# EAGLE design sub_sys_pdu (EAGLE 9.6.0)
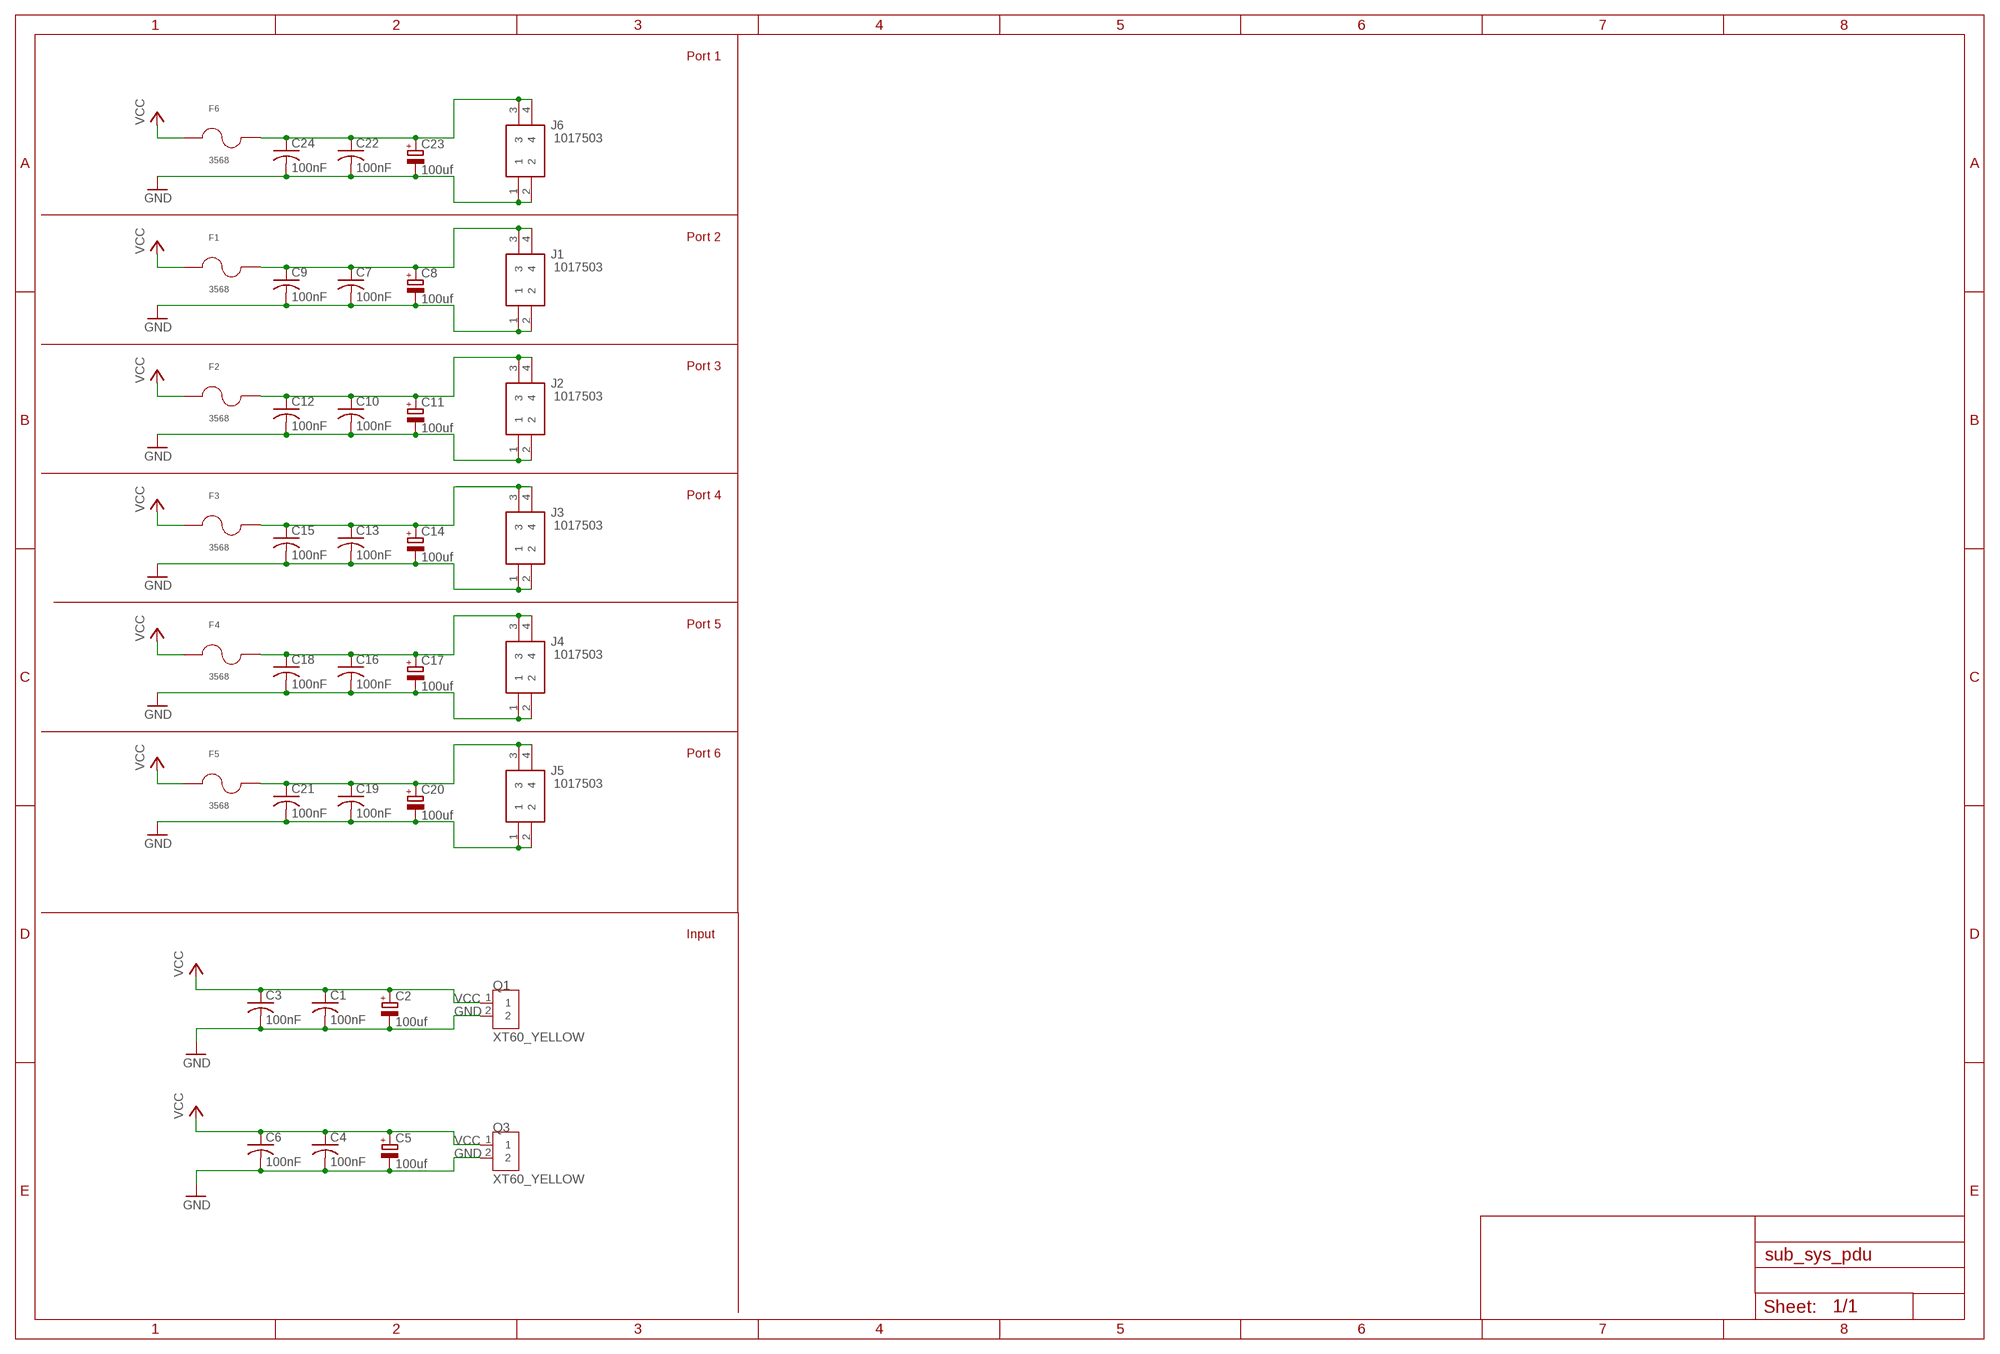
[diagram p0: schematic, sheet 1]

## Parts
C1  100nF  C-USC0805  [C0805]
C2  100uf  CPOL-EUE5-10.5  [E5-10,5]
C3  100nF  C-USC0805  [C0805]
C4  100nF  C-USC0805  [C0805]
C5  100uf  CPOL-EUE5-10.5  [E5-10,5]
C6  100nF  C-USC0805  [C0805]
C7  100nF  C-USC0805  [C0805]
C8  100uf  CPOL-EUE5-10.5  [E5-10,5]
C9  100nF  C-USC0805  [C0805]
C10  100nF  C-USC0805  [C0805]
C11  100uf  CPOL-EUE5-10.5  [E5-10,5]
C12  100nF  C-USC0805  [C0805]
C13  100nF  C-USC0805  [C0805]
C14  100uf  CPOL-EUE5-10.5  [E5-10,5]
C15  100nF  C-USC0805  [C0805]
C16  100nF  C-USC0805  [C0805]
C17  100uf  CPOL-EUE5-10.5  [E5-10,5]
C18  100nF  C-USC0805  [C0805]
C19  100nF  C-USC0805  [C0805]
C20  100uf  CPOL-EUE5-10.5  [E5-10,5]
C21  100nF  C-USC0805  [C0805]
C22  100nF  C-USC0805  [C0805]
C23  100uf  CPOL-EUE5-10.5  [E5-10,5]
C24  100nF  C-USC0805  [C0805]
F1  3568  [FUSE_3568]
F2  3568  [FUSE_3568]
F3  3568  [FUSE_3568]
F4  3568  [FUSE_3568]
F5  3568  [FUSE_3568]
F6  3568  [FUSE_3568]
J1  1017503  [1017503]
J2  1017503  [1017503]
J3  1017503  [1017503]
J4  1017503  [1017503]
J5  1017503  [1017503]
J6  1017503  [1017503]
Q1  XT60_YELLOW  [AMASS_XT60PB-M]
Q3  XT60_YELLOW  [AMASS_XT60PB-M]

## Nets
GND: C1.2 C2.- C3.2 C4.2 C5.- C6.2 C7.2 C8.- C9.2 C10.2 C11.- C12.2 C13.2 C14.- C15.2 C16.2 C17.- C18.2 C19.2 C20.- C21.2 C22.2 C23.- C24.2 J1.1 J1.2 J2.1 J2.2 J3.1 J3.2 J4.1 J4.2 J5.1 J5.2 J6.1 J6.2 Q1.2 Q3.2
N$1: C7.1 C8.+ C9.1 F1.2 F1.4 J1.3 J1.4
N$2: C10.1 C11.+ C12.1 F2.2 F2.4 J2.3 J2.4
N$3: C13.1 C14.+ C15.1 F3.2 F3.4 J3.3 J3.4
N$4: C16.1 C17.+ C18.1 F4.2 F4.4 J4.3 J4.4
N$5: C19.1 C20.+ C21.1 F5.2 F5.4 J5.3 J5.4
N$6: C22.1 C23.+ C24.1 F6.2 F6.4 J6.3 J6.4
VCC: C1.1 C2.+ C3.1 C4.1 C5.+ C6.1 F1.1 F1.3 F2.1 F2.3 F3.1 F3.3 F4.1 F4.3 F5.1 F5.3 F6.1 F6.3 Q1.1 Q3.1

## Notes on the sheet
- Port 1
- Port 2
- Port 3
- Port 4
- Port 5
- Port 6
- Input

## Library data of the parts
C1 C3 C4 C6 C7 C9 C10 C12 C13 C15 C16 C18 C19 C21 C22 C24 = rcl:C-US: CAPACITOR, American symbol; SPICEPREFIX: C
C2 C5 C8 C11 C14 C17 C20 C23 = rcl:CPOL-EU: POLARIZED CAPACITOR, European symbol; SPICEPREFIX: C
F1-F6 = 3568:3568: Auto Fuse Holder; Mini; THM; 1 Fuse; 30Amp; Hi-Temp Nylon; UL94V-0; Brass/Tin; AVAILABILITY: Unavailable; DESCRIPTION: STEMMA CABLE - 150MM/6 LONG 4 PI; MF: Adafruit Industries; MP: 3568; PACKAGE: None; PRICE: None
J1-J6 = 1017503:1017503: Phoenix Contact TDPT Series 5.08mm Pitch, PCB Terminal Block, PCB Mount, 2 Way Source: Datasheet <https://www.phoenixcontact.com/online/portal/gb?uri=pxc-oc-itemdetail:pid=1017503&library=gben&tab=1>; DESCRIPTION: Phoenix Contact TDPT Series 5.08mm Pitch, PCB Terminal Block, PCB Mount, 2 Way; HEIGHT: 19.2mm; MANUFACTURER_NAME: Phoenix Contact; MANUFACTURER_PART_NUMBER: 1017503; MOUSER_PART_NUMBER: 651-1017503; MOUSER_PRICE-STOCK: https://www.mouser.com/Search/Refine.aspx?Keyword=651-1017503
Q1 Q3 = XT60_YELLOW:XT60_YELLOW: Connector 2 pins; AVAILABILITY: Unavailable; DESCRIPTION: Power connector; 65A; PIN: 2; Colour: yellow; MF: Pololu; MP: XT60 YELLOW; PACKAGE: None; PRICE: None

## Board
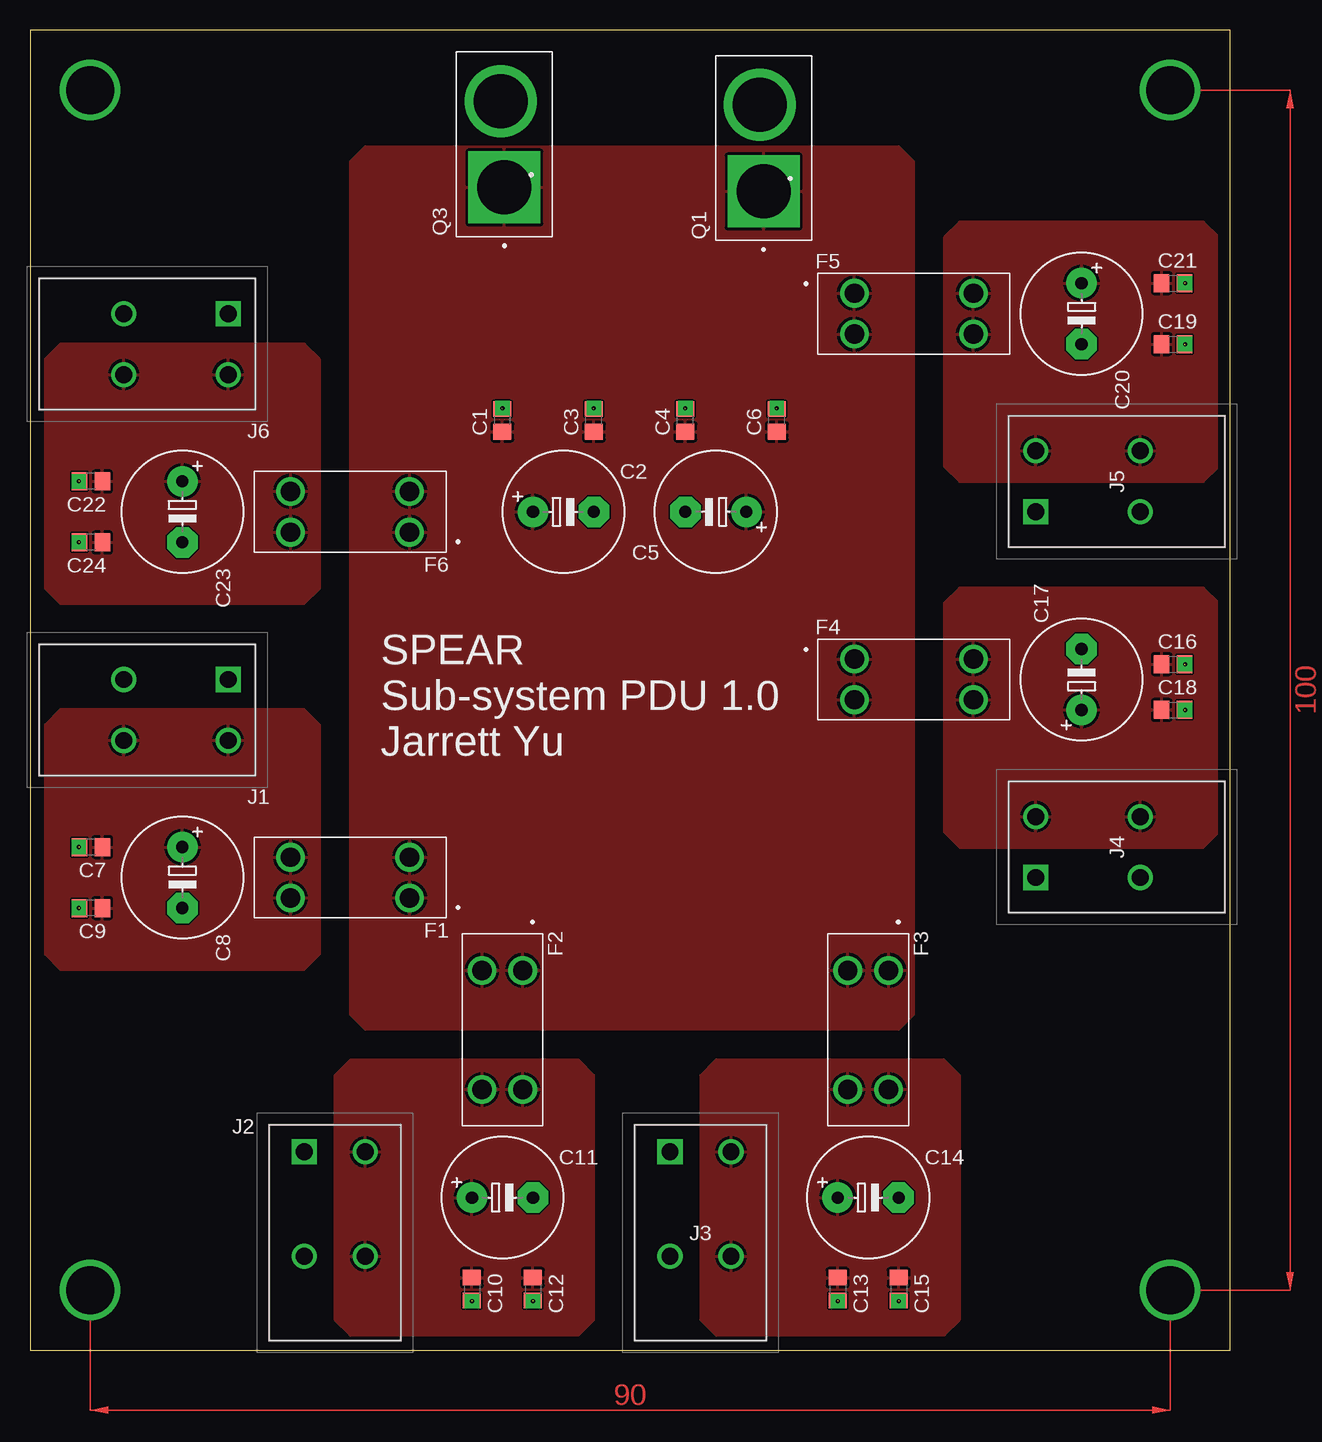
[diagram p1: board, top side]
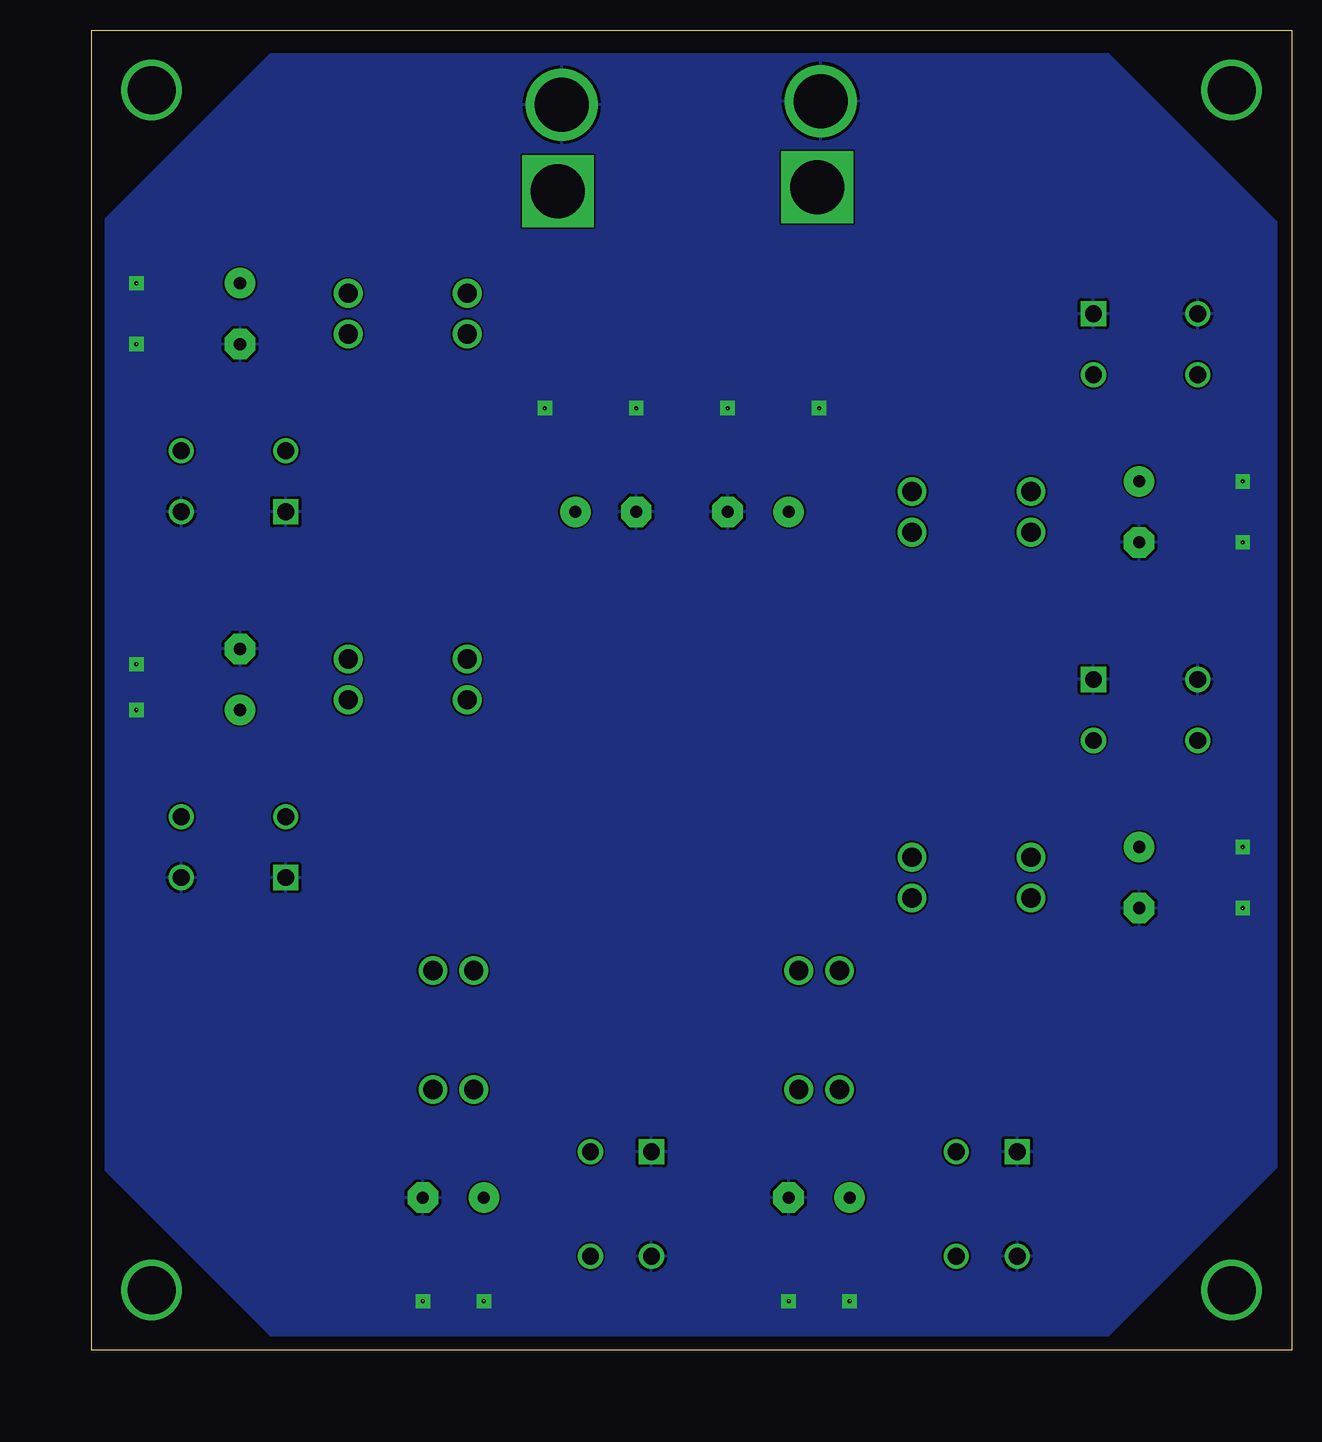
[diagram p2: board, bottom side, seen from below]

Size 100 x 110 mm. Coordinates in mm from the lower left corner, seen from the top.
Outline: 0,0 100,0 100,110 0,110 0,0
Copper layers (1*16): Top 0.035mm / dielectric 1.5mm / Bottom 0.035mm
Design rules "default": minimum track width 6mil, minimum drill 0.35mm, track to track 6mil, track to pad 6mil, pad to pad 6mil, via to via 6mil, smd to smd 6mil, copper to edge 40mil, drill to drill 6mil, minimum pad ring 10mil, minimum via ring 8mil, stop-mask expansion 4mil, vias tented up to drill 0mil, thermal gap 10mil

### Footprints (pad centres in the part's own frame; a part is rotated, then mirrored left to right if it is on the bottom)
C0805 = smd 1.3 x 1.5: 1 -0.95,0; 2 0.95,0
E5-10,5 = drill 1.016 pad 2.54: + -2.54,0 | drill 1.016 pad 2.54 octagon: - 2.54,0
FUSE_3568 = drill 1.6: 1 -4.96,1.7; 2 4.96,1.7; 3 -4.96,-1.7; 4 4.96,-1.7
1017503 = drill 1.4 pad 2.1 square: 1 0,0 | drill 1.4 pad 2.1: 2 0,-8.7; 3 5.08,0; 4 5.08,-8.7
AMASS_XT60PB-M = drill 4.5 pad 6 square: 1 -3.6,0 | drill 4.5 pad 6: 2 3.6,0.305

### Placement (x,y rotation side)
C1  39.37,77.47 90 top
C2  44.45,69.85 0 top
C3  46.99,77.47 90 top
C4  54.61,77.47 90 top
C5  57.15,69.85 180 top
C6  62.23,77.47 90 top
C7  5.08,41.91 180 top
C8  12.7,39.37 270 top
C9  5.08,36.83 180 top
C10  36.83,5.08 270 top
C11  39.37,12.7 0 top
C12  41.91,5.08 270 top
C13  67.31,5.08 270 top
C14  69.85,12.7 0 top
C15  72.39,5.08 270 top
C16  95.25,57.15 0 top
C17  87.63,55.88 90 top
C18  95.25,53.34 0 top
C19  95.25,83.82 0 top
C20  87.63,86.36 270 top
C21  95.25,88.9 0 top
C22  5.08,72.39 180 top
C23  12.7,69.85 270 top
C24  5.08,67.31 180 top
F1  26.67,39.37 180 top
F2  39.37,26.67 270 top
F3  69.85,26.67 270 top
F4  73.66,55.88 0 top
F5  73.66,86.36 0 top
F6  26.67,69.85 180 top
J1  16.51,55.88 270 top
J2  22.86,16.51 0 top
J3  53.34,16.51 0 top
J4  83.82,39.37 90 top
J5  83.82,69.85 90 top
J6  16.51,86.36 270 top
Q1  61.13,100.16 90 top
Q3  39.54,100.48 90 top

### Tracks (layer width: path | path; a pad name or v marks a point on that pad's centre or on a via)
GND  (via drill 0.35 pad 1.2)  (16 unrouted)
  other vias: 39.37,78.49 4.06,72.39 46.99,78.49 54.61,78.49 62.23,78.49 4.06,67.31 4.06,41.91 4.06,36.83 36.83,4.06 41.91,4.06 67.31,4.06 72.39,4.06 96.27,53.34 96.27,57.15 96.27,83.82 96.27,88.9
  pour Bottom: 1.27,15.24 1.27,93.98 15.24,107.95 85.09,107.95 99.06,93.98 99.06,15.24 85.09,1.27 15.24,1.27
N$1
  pour Top: 22.86,53.34 2.54,53.34 1.27,52.07 1.27,33.02 2.54,31.75 22.86,31.75 24.13,33.02 24.13,52.07
N$2
  pour Top: 45.72,24.13 26.67,24.13 25.4,22.86 25.4,2.54 26.67,1.27 45.72,1.27 46.99,2.54 46.99,22.86
N$3
  pour Top: 76.2,24.13 57.15,24.13 55.88,22.86 55.88,2.54 57.15,1.27 76.2,1.27 77.47,2.54 77.47,22.86
N$4
  pour Top: 76.2,62.23 76.2,43.18 77.47,41.91 97.79,41.91 99.06,43.18 99.06,62.23 97.79,63.5 77.47,63.5
N$5
  pour Top: 76.2,92.71 76.2,73.66 77.47,72.39 97.79,72.39 99.06,73.66 99.06,92.71 97.79,93.98 77.47,93.98
N$6
  pour Top: 22.86,83.82 2.54,83.82 1.27,82.55 1.27,63.5 2.54,62.23 22.86,62.23 24.13,63.5 24.13,82.55
N$23  (via drill 4)
  other vias: 5,105
N$24  (via drill 4)
  other vias: 5,5
N$25  (via drill 4)
  other vias: 95,5
N$26  (via drill 4)
  other vias: 95,105
VCC
  pour Top: 31.75,100.33 72.39,100.33 73.66,99.06 73.66,27.94 72.39,26.67 27.94,26.67 26.67,27.94 26.67,99.06 27.94,100.33
(copper drawn outside any net)
  shapes: Top area x2

### Text on the board
tNames: SPEAR | Sub-system PDU 1.0 | Jarrett Yu